# EAGLE design brainslug_v2 (EAGLE 6.5.0)
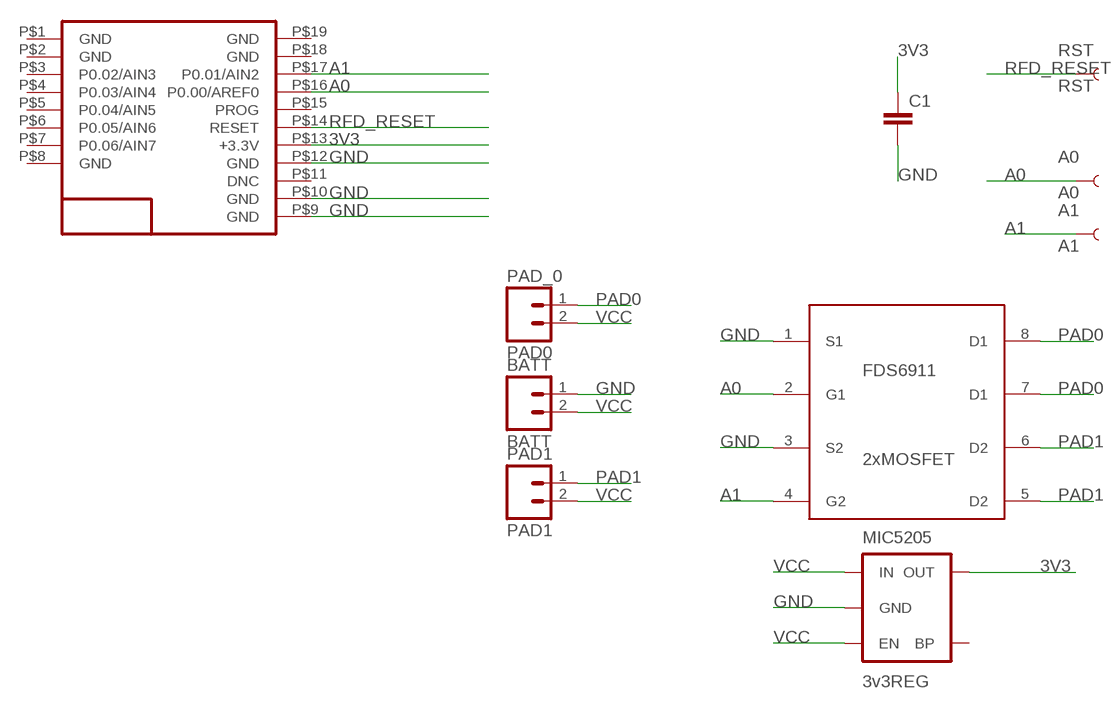
[diagram p0: schematic, sheet 1]

## Parts
A0  A0  TEST-POINT3  [PAD.03X.03]
A1  A1  TEST-POINT3  [PAD.03X.03]
BATT  BATT  M02-JST-2MM-SMT  [JST-2-SMD]
C1  CAP  [C3216]
FDS6911  2xMOSFET  FDS6911  [SO8]
MIC5205  3v3REG  MIC52053.3V  [SOT23-5]
PAD1  PAD1  M02-JST-2MM-SMT  [JST-2-SMD]
PAD_0  PAD0  M02-JST-2MM-SMT  [JST-2-SMD]
RST  RST  TEST-POINT3  [PAD.03X.03]
U$1  RFD22301  [RFD21733]

## Nets
3V3: C1.1 MIC5205.5(OUT) U$1.P$13(+3.3V)
A0: A0.P$1 FDS6911.2(G1) U$1.P$16(P0.00/AREF0)
A1: A1.P$1 FDS6911.4(G2) U$1.P$17(P0.01/AIN2)
GND: BATT.1 C1.2 FDS6911.1(S1) FDS6911.3(S2) MIC5205.2(GND) U$1.P$9(GND) U$1.P$10(GND) U$1.P$12(GND)
PAD0: FDS6911.7(D1) FDS6911.8(D1) PAD_0.1
PAD1: FDS6911.5(D2) FDS6911.6(D2) PAD1.1
RFD_RESET: RST.P$1 U$1.P$14(RESET)
VCC: BATT.2 MIC5205.1(IN) MIC5205.3(EN) PAD1.2 PAD_0.2
Unconnected: MIC5205.4(BP) U$1.P$1(GND) U$1.P$2(GND) U$1.P$3(P0.02/AIN3) U$1.P$4(P0.03/AIN4) U$1.P$5(P0.04/AIN5) U$1.P$6(P0.05/AIN6) U$1.P$7(P0.06/AIN7) U$1.P$8(GND) U$1.P$11(DNC) U$1.P$15(PROG) U$1.P$18(GND) U$1.P$19(GND)

## Library data of the parts
A0 A1 RST = SparkFun-Passives:TEST-POINT: Bare copper test points for troubleshooting or ICT
BATT PAD1 PAD_0 = SparkFun-Connectors:M02: Header 2 Standard 2-pin 0.1" header. Use with straight break away headers (SKU : PRT-00116), right angle break away headers (PRT-00553), swiss pins (PRT-00743), machine pins (PRT-00117), and female headers (PRT-00115). Molex polarized connector foot print use with SKU : PRT-08233 with associated crimp pins and housings.
C1 = AKA_test:CAP: Capacitor Standard 0603 ceramic capacitor, and 0.1" leaded capacitor.
FDS6911 = AKA_test:FDS6911: FDS6911 Dual N-Channel Logic Level PowerTrench® MOSFET 20V, 7.5A, 13mΩ
MIC5205 = SparkFun-PowerIC:MIC5205: MIC5205 150mA vreg 3.3V - VREG-00822 5V - VREG-00823; PROD_ID: VREG-00822
U$1 = RFD22301-11.25.13:RFD22301: RF Digital RFD22301

## Board
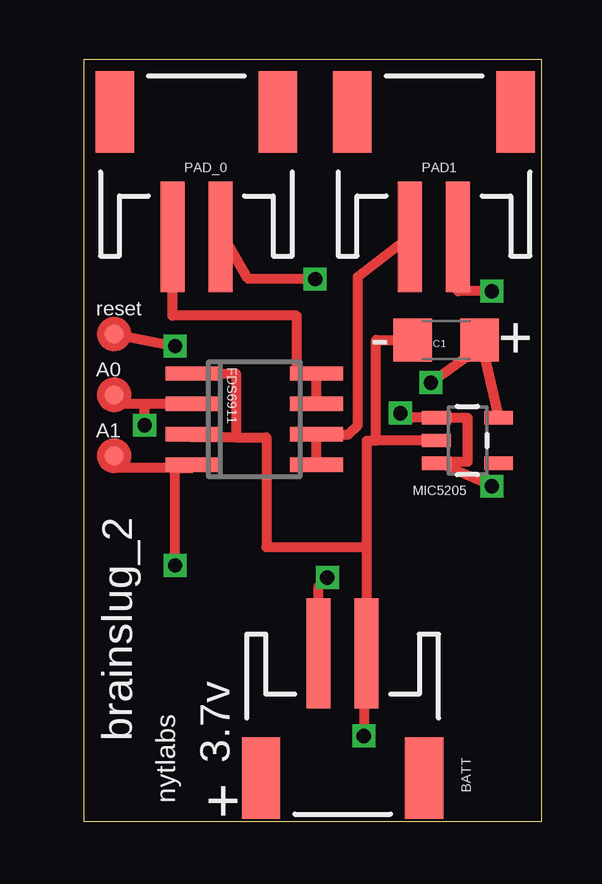
[diagram p1: board, top side]
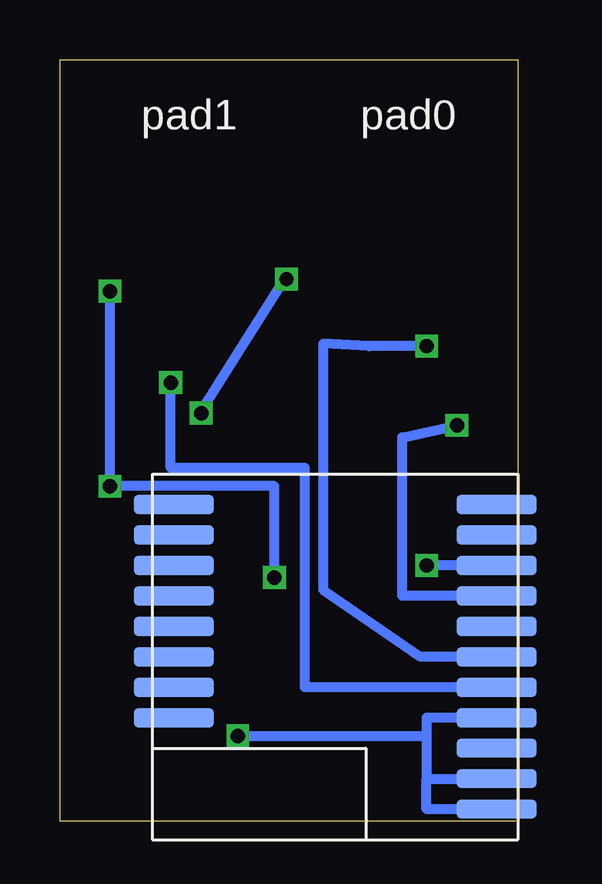
[diagram p2: board, bottom side, seen from below]

Size 19.1 x 31.74 mm. Coordinates in mm from the lower left corner, seen from the top.
Outline: 0,0 19.1,0 19.1,31.74 0,31.74 0,0
Copper layers (1*16): Top 0.0356mm / dielectric 1.5011mm / Bottom 0.0356mm
Design rules "LaenPCBOrder": minimum track width 6mil, minimum drill 13mil, track to track 6mil, track to pad 6mil, pad to pad 6mil, via to via 6mil, smd to smd 6mil, copper to edge 15mil, drill to drill 6mil, minimum pad ring 7mil, minimum via ring 7mil, stop-mask expansion 3mil, vias tented up to drill 0mil, thermal gap 10mil

### Footprints (pad centres in the part's own frame; a part is rotated, then mirrored left to right if it is on the bottom)
PAD.03X.03 = smd 0.762 x 0.762: P$1 0,0
JST-2-SMD = smd 1 x 4.6: 1 -1,-3.7; 2 1,-3.7 | smd 1.6 x 3.4: NC1 -3.4,1.5; NC2 3.4,1.5
C3216 = smd 1.6 x 1.8: 1 -1.4,0; 2 1.4,0
SO8 = smd 0.6 x 2.2: 1 -1.905,-2.6; 2 -0.635,-2.6; 3 0.635,-2.6; 4 1.905,-2.6; 5 1.905,2.6; 6 0.635,2.6; 7 -0.635,2.6; 8 -1.905,2.6
SOT23-5 = smd 0.55 x 1.2: 1 -0.95,-1.3; 2 0,-1.3; 3 0.95,-1.3; 4 0.95,1.3; 5 -0.95,1.3
RFD21733 = smd 3.353 x 0.813: P$1 -6.731,6.35; P$2 -6.731,5.08; P$3 -6.731,3.81; P$4 -6.731,2.54; P$5 -6.731,1.27; P$6 -6.731,0; P$7 -6.731,-1.27; P$8 -6.731,-2.54; P$9 6.731,-6.35; P$10 6.731,-5.08; P$11 6.731,-3.81; P$12 6.731,-2.54; P$13 6.731,-1.27; P$14 6.731,0; P$15 6.731,1.27; P$16 6.731,2.54; P$17 6.731,3.81; P$18 6.731,5.08; P$19 6.731,6.35

### Placement (x,y rotation side)
A0  1.27,17.78 0 top
A1  1.27,15.24 0 top
BATT  10.79,3.3 180 top
C1  15.11,20.07 180 top
FDS6911  7.11,16.76 270 top
MIC5205  16,15.88 270 top
PAD1  14.61,28.07 0 top
PAD_0  4.7,28.07 0 top
RST  1.27,20.32 0 top
U$1  7.62,6.86 0 bottom

### Tracks (layer width: path | path; a pad name or v marks a point on that pad's centre or on a via)
3V3  (via drill 0.6)
  Top 0.406: C1.1 16.59,19.86 | 16.59,19.86 17.3,16.76 | 17.3,16.76 MIC5205.5 | 17.3,16.76 17.27,16.76 | v14.48,18.29 16.59,19.81 16.59,19.86
  Bottom 0.406: U$1.P$13 8.89,5.59 8.89,14.73 14.48,14.73 v14.48,18.29
A0  (via drill 0.6)
  Top 0.406: FDS6911.2 2.54,17.4 | 2.54,17.4 1.27,17.4 A0.P$1 | v2.54,16.51 2.54,17.4
  Bottom 0.406: U$1.P$16 4.83,9.4 4.83,16 v2.54,16.51
A1  (via drill 0.6)
  Top 0.406: v3.81,10.67 3.81,14.73 | 3.81,14.73 4.51,14.73 FDS6911.4 | 3.81,14.73 1.27,14.73 A1.P$1
  Bottom 0.406: U$1.P$17 v3.81,10.67
GND  (via drill 0.6)
  Top 0.406: v11.68,3.56 11.68,7 BATT.1 11.79,11.43 | FDS6911.1 6.35,18.67 6.35,16 | 6.35,16 4.51,16 FDS6911.3 | MIC5205.2 12.19,15.88 | 11.79,11.43 11.79,15.88 12.19,15.88 | 12.19,15.88 12.19,20.07 C1.2 | 6.35,16 7.62,16 7.62,11.43 11.79,11.43
  Bottom 0.406: U$1.P$9 3.81,0.51 3.81,1.78 | 3.81,1.78 U$1.P$10 | U$1.P$12 3.81,4.32 3.81,3.56 | 3.81,3.56 3.81,1.78 | v11.68,3.56 3.81,3.56
PAD0
  Top 0.406: FDS6911.7 FDS6911.8 8.89,18.67 8.89,21.08 3.7,21.08 PAD_0.1
PAD1
  Top 0.406: FDS6911.5 FDS6911.6 11.05,16.13 11.43,16.51 11.43,22.7 PAD1.1
RFD_RESET  (via drill 0.6)
  Top 0.406: RST.P$1 v3.81,19.81
  Bottom 0.406: v3.81,19.81 6.2,19.81 8.13,19.91 8.13,9.65 4.06,6.86 U$1.P$14
VCC  (via drill 0.6)
  Top 0.406: v17.02,13.97 14.7,14.99 | BATT.2 9.79,9.79 v10.16,10.16 | v13.21,17.02 13.46,16.82 MIC5205.1 16,16.82 16,14.99 14.7,14.99 | v9.65,22.61 6.86,22.61 5.84,24.38 PAD_0.2 | v17.02,22.1 15.61,22.1 PAD1.2 | 14.7,14.99 MIC5205.3
  Bottom 0.406: v17.02,22.1 v17.02,13.97 10.16,13.97 v10.16,10.16 | v13.21,17.02 13.21,17.11 9.75,22.61 v9.65,22.61
(copper drawn outside any net)
  shapes: Top circle x3

### Text on the board
tPlace: reset | A0 | A1 | brainslug_2 | 3.7v | nytlabs
bPlace: pad0 | pad1
tNames: - | + | +